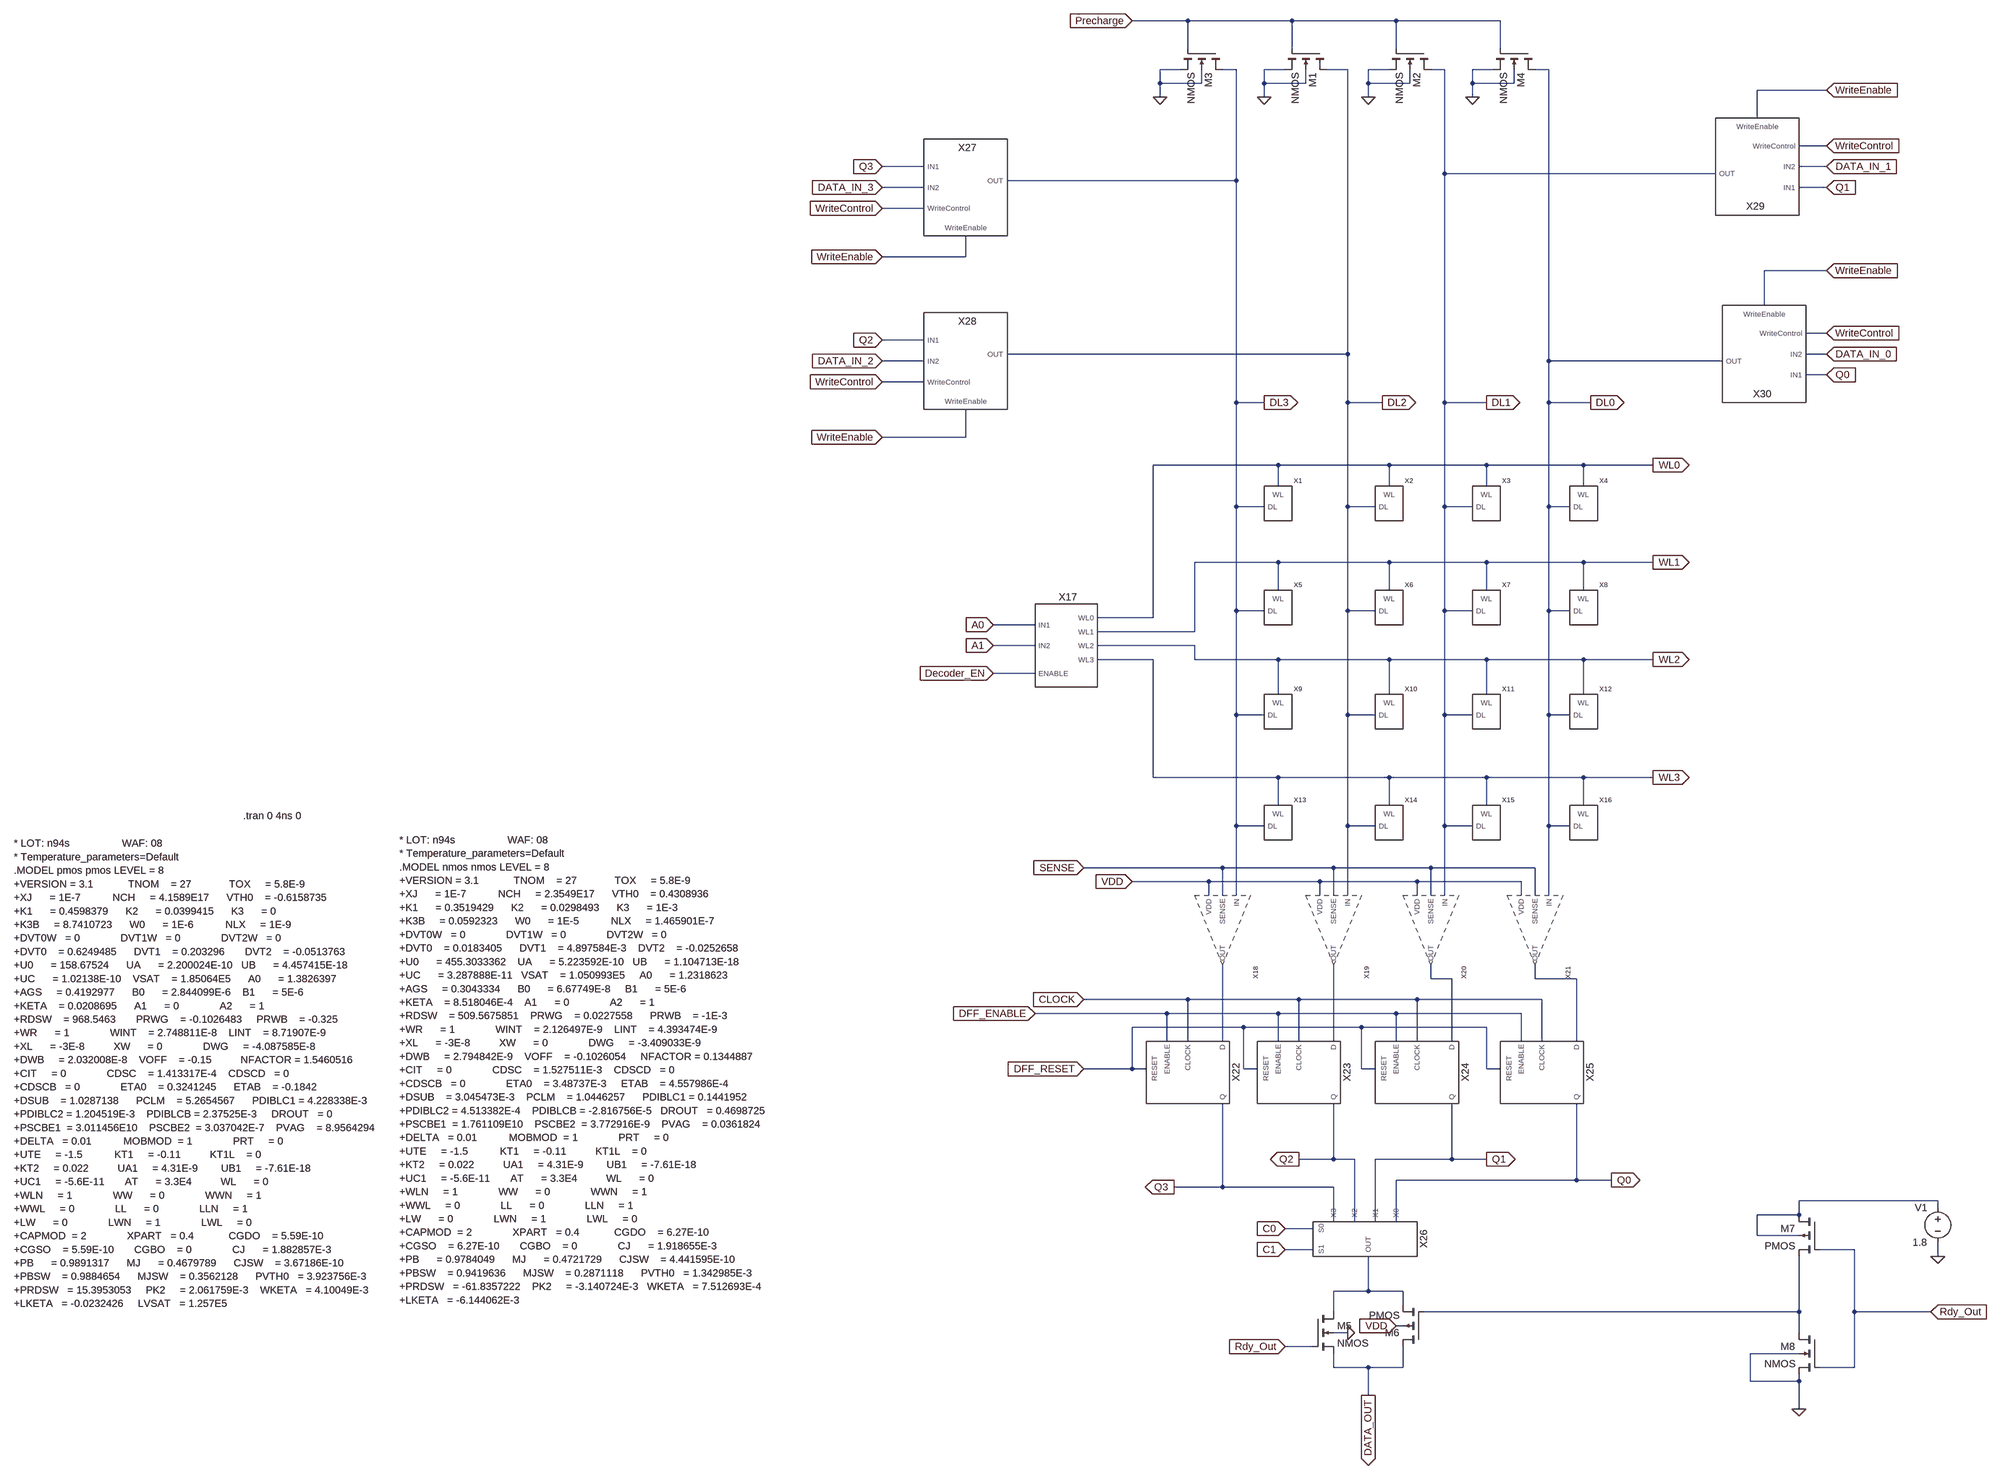
[diagram p0: schematic 4X4_DRAM.asc]
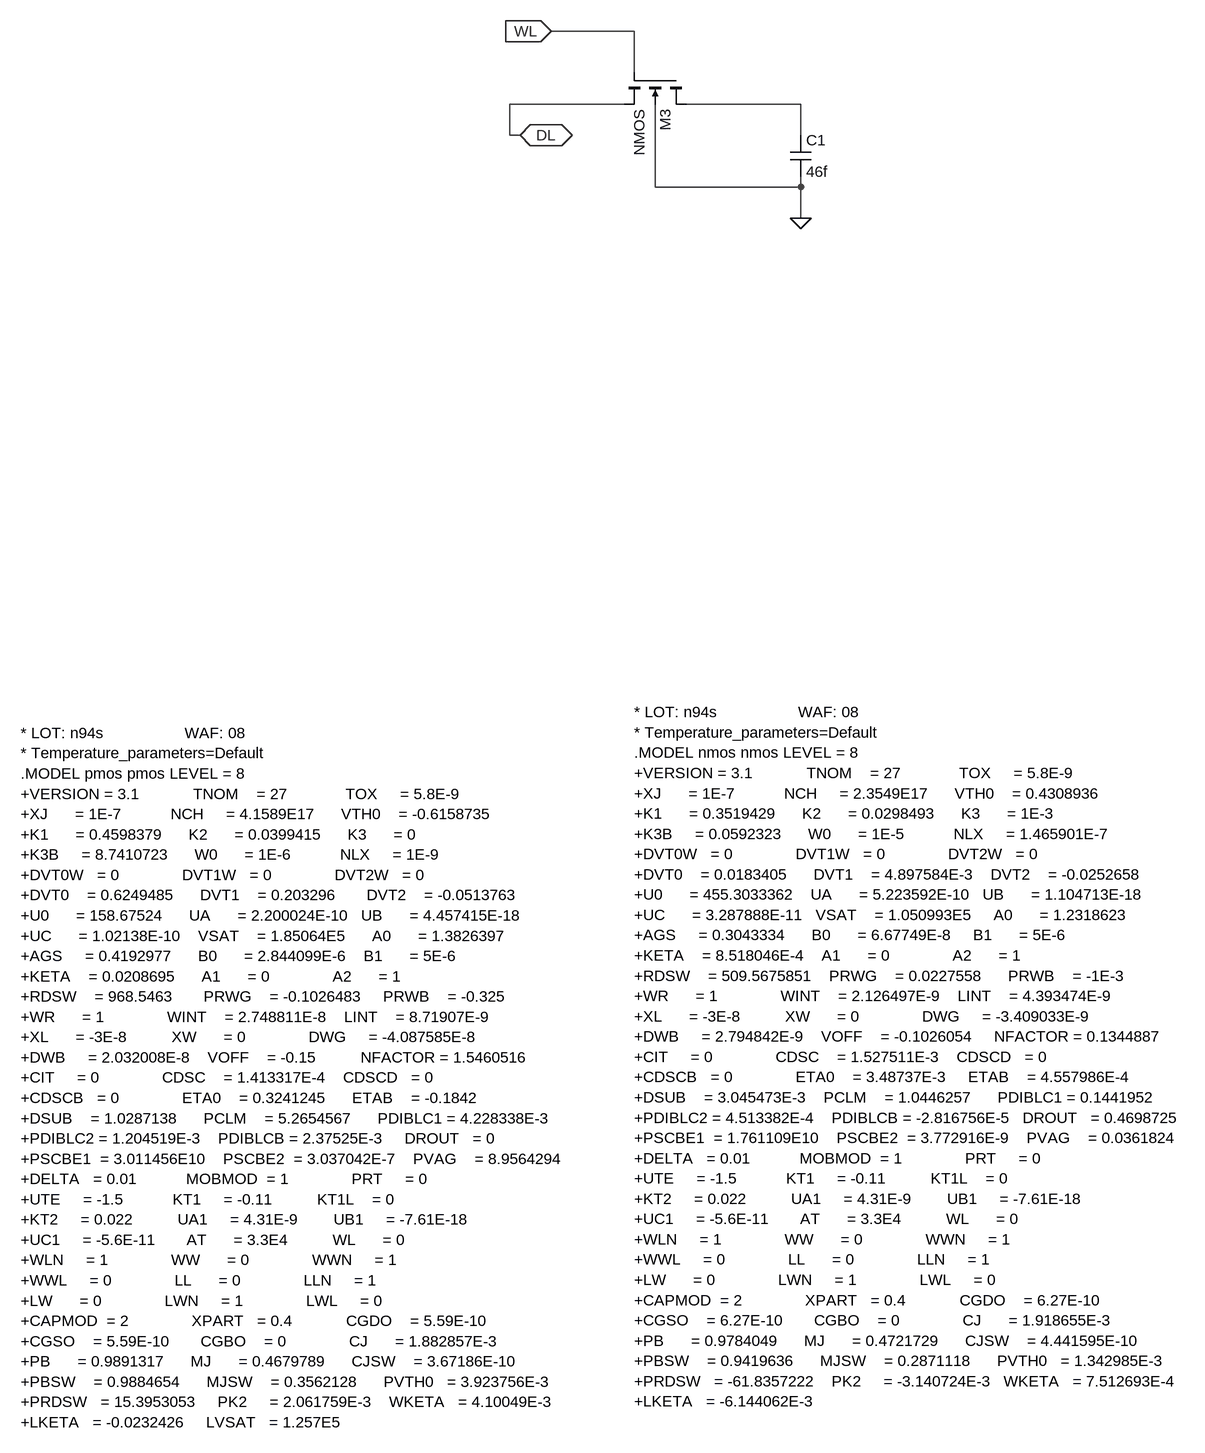
[diagram p1: sub-circuit 1t1c_cell.asc]
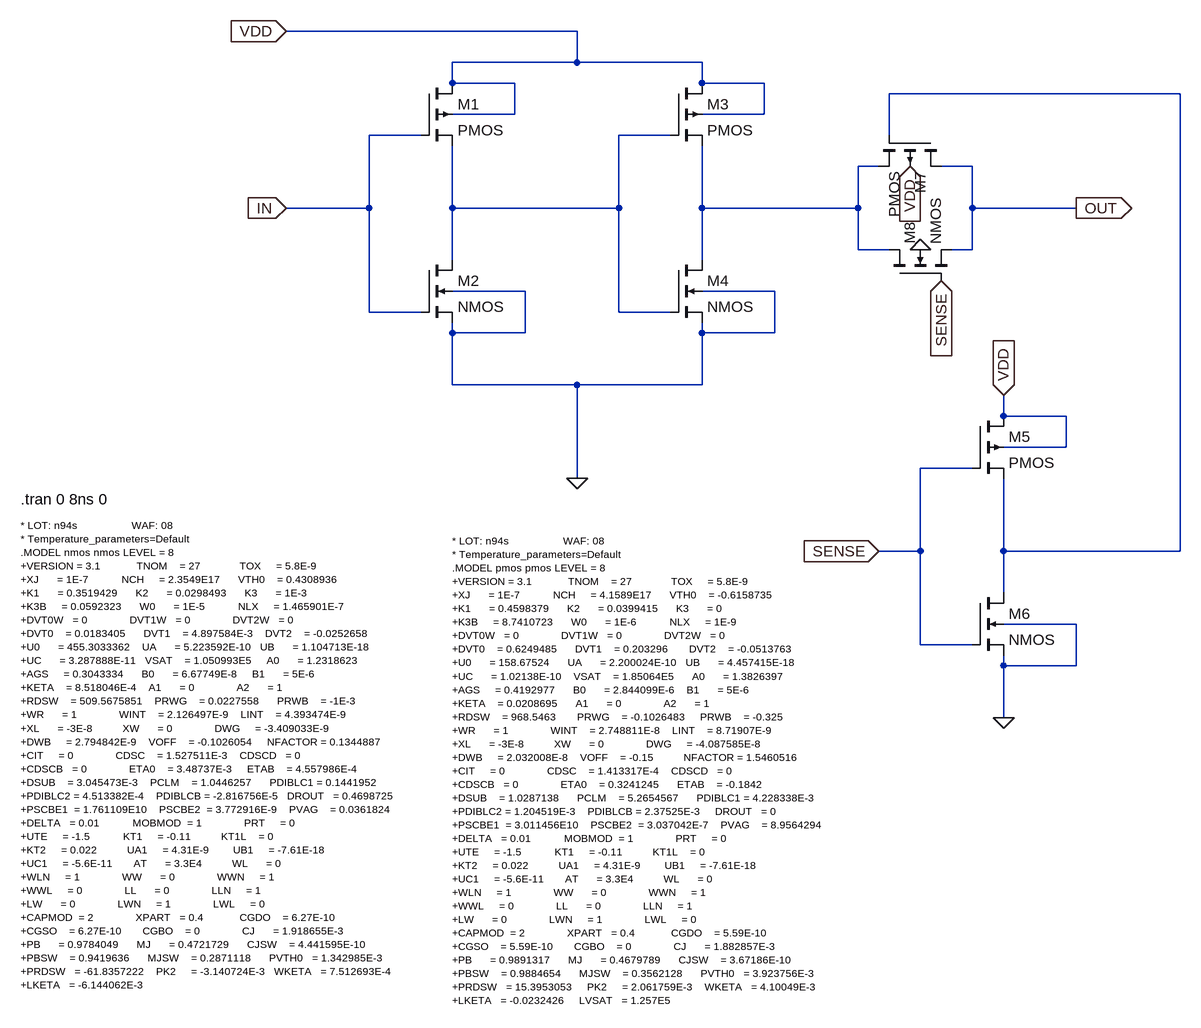
[diagram p2: sub-circuit sense_amplifier_en.asc]
4X4_DRAM.asc, the LTspice schematic file:
Version 4
SHEET 1 1972 2572
WIRE -640 -1056 -768 -1056
WIRE -400 -1056 -640 -1056
WIRE -160 -1056 -400 -1056
WIRE 80 -1056 -160 -1056
WIRE -640 -992 -640 -1056
WIRE -400 -992 -400 -1056
WIRE -160 -992 -160 -1056
WIRE 80 -992 80 -1056
WIRE -656 -944 -704 -944
WIRE -528 -944 -560 -944
WIRE -416 -944 -464 -944
WIRE -272 -944 -320 -944
WIRE -176 -944 -224 -944
WIRE -48 -944 -80 -944
WIRE 64 -944 16 -944
WIRE 192 -944 160 -944
WIRE -704 -912 -704 -944
WIRE -608 -912 -608 -944
WIRE -608 -912 -704 -912
WIRE -464 -912 -464 -944
WIRE -368 -912 -368 -944
WIRE -368 -912 -464 -912
WIRE -224 -912 -224 -944
WIRE -128 -912 -128 -944
WIRE -128 -912 -224 -912
WIRE 16 -912 16 -944
WIRE 112 -912 112 -944
WIRE 112 -912 16 -912
WIRE 832 -896 672 -896
WIRE -704 -880 -704 -912
WIRE -464 -880 -464 -912
WIRE -224 -880 -224 -912
WIRE 16 -880 16 -912
WIRE 672 -832 672 -896
WIRE 832 -768 768 -768
WIRE -1248 -720 -1344 -720
WIRE 832 -720 768 -720
WIRE -48 -704 -48 -944
WIRE 576 -704 -48 -704
WIRE -528 -688 -528 -944
WIRE -528 -688 -1056 -688
WIRE -1248 -672 -1344 -672
WIRE 832 -672 768 -672
WIRE -1248 -624 -1344 -624
WIRE -1152 -512 -1152 -560
WIRE -1152 -512 -1344 -512
WIRE 832 -480 688 -480
WIRE 688 -400 688 -480
WIRE 832 -336 784 -336
WIRE -1248 -320 -1344 -320
WIRE -272 -288 -272 -944
WIRE -272 -288 -1056 -288
WIRE 832 -288 784 -288
WIRE -1248 -272 -1344 -272
WIRE 192 -272 192 -944
WIRE 592 -272 192 -272
WIRE 832 -240 784 -240
WIRE -1248 -224 -1344 -224
WIRE -528 -176 -528 -688
WIRE -464 -176 -528 -176
WIRE -272 -176 -272 -288
WIRE -192 -176 -272 -176
WIRE -48 -176 -48 -704
WIRE 48 -176 -48 -176
WIRE 192 -176 192 -272
WIRE 288 -176 192 -176
WIRE -1152 -96 -1152 -160
WIRE -1152 -96 -1344 -96
WIRE -432 -32 -720 -32
WIRE -176 -32 -432 -32
WIRE 48 -32 -176 -32
WIRE 272 -32 48 -32
WIRE 432 -32 272 -32
WIRE -432 16 -432 -32
WIRE -176 16 -176 -32
WIRE 48 16 48 -32
WIRE 272 16 272 -32
WIRE -528 64 -528 -176
WIRE -464 64 -528 64
WIRE -272 64 -272 -176
WIRE -208 64 -272 64
WIRE -48 64 -48 -176
WIRE 16 64 -48 64
WIRE 192 64 192 -176
WIRE 240 64 192 64
WIRE -432 192 -624 192
WIRE -176 192 -432 192
WIRE 48 192 -176 192
WIRE 272 192 48 192
WIRE 432 192 272 192
WIRE -432 256 -432 192
WIRE -176 256 -176 192
WIRE 48 256 48 192
WIRE 272 256 272 192
WIRE -528 304 -528 64
WIRE -464 304 -528 304
WIRE -272 304 -272 64
WIRE -208 304 -272 304
WIRE -48 304 -48 64
WIRE 16 304 -48 304
WIRE 192 304 192 64
WIRE 240 304 192 304
WIRE -720 320 -720 -32
WIRE -720 320 -848 320
WIRE -992 336 -1088 336
WIRE -624 352 -624 192
WIRE -624 352 -848 352
WIRE -992 384 -1088 384
WIRE -624 384 -848 384
WIRE -720 416 -848 416
WIRE -624 416 -624 384
WIRE -432 416 -624 416
WIRE -176 416 -432 416
WIRE 48 416 -176 416
WIRE 272 416 48 416
WIRE 432 416 272 416
WIRE -992 448 -1088 448
WIRE -432 496 -432 416
WIRE -176 496 -176 416
WIRE 48 496 48 416
WIRE 272 496 272 416
WIRE -528 544 -528 304
WIRE -464 544 -528 544
WIRE -272 544 -272 304
WIRE -208 544 -272 544
WIRE -48 544 -48 304
WIRE 16 544 -48 544
WIRE 192 544 192 304
WIRE 240 544 192 544
WIRE -720 688 -720 416
WIRE -432 688 -720 688
WIRE -176 688 -432 688
WIRE 48 688 -176 688
WIRE 272 688 48 688
WIRE 432 688 272 688
WIRE -432 752 -432 688
WIRE -176 752 -176 688
WIRE 48 752 48 688
WIRE 272 752 272 688
WIRE -528 800 -528 544
WIRE -464 800 -528 800
WIRE -272 800 -272 544
WIRE -208 800 -272 800
WIRE -48 800 -48 544
WIRE 16 800 -48 800
WIRE 192 800 192 544
WIRE 240 800 192 800
WIRE -560 896 -880 896
WIRE -304 896 -560 896
WIRE -80 896 -304 896
WIRE 160 896 -80 896
WIRE -592 928 -768 928
WIRE -336 928 -592 928
WIRE -112 928 -336 928
WIRE 128 928 -112 928
WIRE -592 960 -592 928
WIRE -560 960 -560 896
WIRE -528 960 -528 800
WIRE -336 960 -336 928
WIRE -304 960 -304 896
WIRE -272 960 -272 800
WIRE -112 960 -112 928
WIRE -80 960 -80 896
WIRE -48 960 -48 800
WIRE 128 960 128 928
WIRE 160 960 160 896
WIRE 192 960 192 800
WIRE -80 1152 -80 1120
WIRE -32 1152 -80 1152
WIRE 160 1152 160 1120
WIRE 256 1152 160 1152
WIRE -640 1200 -880 1200
WIRE -384 1200 -640 1200
WIRE -112 1200 -384 1200
WIRE 176 1200 -112 1200
WIRE -688 1232 -992 1232
WIRE -432 1232 -688 1232
WIRE -160 1232 -432 1232
WIRE 128 1232 -160 1232
WIRE -512 1264 -768 1264
WIRE -240 1264 -512 1264
WIRE 48 1264 -240 1264
WIRE -688 1296 -688 1232
WIRE -640 1296 -640 1200
WIRE -560 1296 -560 1120
WIRE -432 1296 -432 1232
WIRE -384 1296 -384 1200
WIRE -304 1296 -304 1120
WIRE -160 1296 -160 1232
WIRE -112 1296 -112 1200
WIRE -32 1296 -32 1152
WIRE 128 1296 128 1232
WIRE 176 1296 176 1200
WIRE 256 1296 256 1152
WIRE -768 1360 -768 1264
WIRE -768 1360 -880 1360
WIRE -736 1360 -768 1360
WIRE -512 1360 -512 1264
WIRE -480 1360 -512 1360
WIRE -240 1360 -240 1264
WIRE -208 1360 -240 1360
WIRE 48 1360 48 1264
WIRE 80 1360 48 1360
WIRE -304 1568 -304 1440
WIRE -304 1568 -384 1568
WIRE -256 1568 -304 1568
WIRE -32 1568 -32 1440
WIRE -32 1568 -208 1568
WIRE 48 1568 -32 1568
WIRE 256 1616 256 1440
WIRE 256 1616 -160 1616
WIRE 336 1616 256 1616
WIRE -560 1632 -560 1440
WIRE -560 1632 -672 1632
WIRE -304 1632 -560 1632
WIRE 1088 1664 768 1664
WIRE 1088 1680 1088 1664
WIRE 768 1696 768 1664
WIRE 768 1696 672 1696
WIRE -304 1712 -304 1632
WIRE -256 1712 -256 1568
WIRE -208 1712 -208 1568
WIRE -160 1712 -160 1616
WIRE -352 1728 -416 1728
WIRE 672 1744 672 1696
WIRE 768 1744 672 1744
WIRE -352 1776 -416 1776
WIRE 896 1776 816 1776
WIRE 1088 1792 1088 1760
WIRE -224 1872 -224 1792
WIRE -224 1872 -304 1872
WIRE -144 1872 -224 1872
WIRE -144 1904 -144 1872
WIRE -304 1920 -304 1872
WIRE 768 1920 768 1792
WIRE 768 1920 -96 1920
WIRE 896 1920 896 1776
WIRE 1072 1920 896 1920
WIRE -144 1952 -160 1952
WIRE -272 1968 -304 1968
WIRE 768 1968 768 1920
WIRE -352 2000 -416 2000
WIRE 768 2016 656 2016
WIRE -304 2048 -304 2016
WIRE -224 2048 -304 2048
WIRE -144 2048 -144 2000
WIRE -144 2048 -224 2048
WIRE 896 2048 896 1920
WIRE 896 2048 816 2048
WIRE 656 2080 656 2016
WIRE 768 2080 768 2064
WIRE 768 2080 656 2080
WIRE -224 2112 -224 2048
WIRE 768 2144 768 2080
FLAG -704 -880 0
FLAG -768 -1056 Precharge
IOPIN -768 -1056 In
FLAG -464 -880 0
FLAG -224 -880 0
FLAG 16 -880 0
FLAG -672 1632 Q3
IOPIN -672 1632 Out
FLAG -384 1568 Q2
IOPIN -384 1568 Out
FLAG 48 1568 Q1
IOPIN 48 1568 Out
FLAG 336 1616 Q0
IOPIN 336 1616 Out
FLAG -224 2112 DATA_OUT
IOPIN -224 2112 Out
FLAG -1344 -720 Q3
IOPIN -1344 -720 In
FLAG -1344 -672 DATA_IN_3
IOPIN -1344 -672 In
FLAG 832 -768 WriteControl
IOPIN 832 -768 In
FLAG 832 -672 Q1
IOPIN 832 -672 In
FLAG 832 -336 WriteControl
IOPIN 832 -336 In
FLAG 832 -288 DATA_IN_0
IOPIN 832 -288 In
FLAG 832 -240 Q0
IOPIN 832 -240 In
FLAG 832 -720 DATA_IN_1
IOPIN 832 -720 In
FLAG 832 -896 WriteEnable
IOPIN 832 -896 In
FLAG 832 -480 WriteEnable
IOPIN 832 -480 In
FLAG -1344 -624 WriteControl
IOPIN -1344 -624 In
FLAG -1344 -512 WriteEnable
IOPIN -1344 -512 In
FLAG -1344 -320 Q2
IOPIN -1344 -320 In
FLAG -1344 -272 DATA_IN_2
IOPIN -1344 -272 In
FLAG -1344 -224 WriteControl
IOPIN -1344 -224 In
FLAG -1344 -96 WriteEnable
IOPIN -1344 -96 In
FLAG -1088 336 A0
IOPIN -1088 336 In
FLAG -1088 384 A1
IOPIN -1088 384 In
FLAG -1088 448 Decoder_EN
IOPIN -1088 448 In
FLAG -880 1360 DFF_RESET
IOPIN -880 1360 In
FLAG -992 1232 DFF_ENABLE
IOPIN -992 1232 In
FLAG -880 1200 CLOCK
IOPIN -880 1200 In
FLAG -416 1728 C0
IOPIN -416 1728 In
FLAG -416 1776 C1
IOPIN -416 1776 In
FLAG -768 928 VDD
IOPIN -768 928 In
FLAG -880 896 SENSE
IOPIN -880 896 In
FLAG -160 1952 VDD
IOPIN -160 1952 In
FLAG -272 1968 0
FLAG 768 2144 0
FLAG 1088 1792 0
FLAG 1072 1920 Rdy_Out
IOPIN 1072 1920 In
FLAG -416 2000 Rdy_Out
IOPIN -416 2000 In
FLAG 432 -32 WL0
IOPIN 432 -32 Out
FLAG 432 192 WL1
IOPIN 432 192 Out
FLAG 432 416 WL2
IOPIN 432 416 Out
FLAG 432 688 WL3
IOPIN 432 688 Out
FLAG 288 -176 DL0
IOPIN 288 -176 Out
FLAG 48 -176 DL1
IOPIN 48 -176 Out
FLAG -192 -176 DL2
IOPIN -192 -176 Out
FLAG -464 -176 DL3
IOPIN -464 -176 Out
SYMBOL nmos4 -560 -992 R90
SYMATTR InstName M3
SYMATTR Value2 l=180n w=440n
SYMBOL 1T1C_CELL -432 64 R0
SYMATTR InstName X1
SYMBOL 1T1C_CELL -176 64 R0
SYMATTR InstName X2
SYMBOL 1T1C_CELL 48 64 R0
SYMATTR InstName X3
SYMBOL 1T1C_CELL 272 64 R0
SYMATTR InstName X4
SYMBOL 1T1C_CELL -432 304 R0
SYMATTR InstName X5
SYMBOL 1T1C_CELL -176 304 R0
SYMATTR InstName X6
SYMBOL 1T1C_CELL 48 304 R0
SYMATTR InstName X7
SYMBOL 1T1C_CELL 272 304 R0
SYMATTR InstName X8
SYMBOL 1T1C_CELL -432 544 R0
SYMATTR InstName X9
SYMBOL 1T1C_CELL -176 544 R0
SYMATTR InstName X10
SYMBOL 1T1C_CELL 48 544 R0
SYMATTR InstName X11
SYMBOL 1T1C_CELL 272 544 R0
SYMATTR InstName X12
SYMBOL 1T1C_CELL -432 800 R0
SYMATTR InstName X13
SYMBOL 1T1C_CELL -176 800 R0
SYMATTR InstName X14
SYMBOL 1T1C_CELL 48 800 R0
SYMATTR InstName X15
SYMBOL 1T1C_CELL 272 800 R0
SYMATTR InstName X16
SYMBOL nmos4 -320 -992 R90
SYMATTR InstName M1
SYMATTR Value2 l=180n w=440n
SYMBOL nmos4 -80 -992 R90
SYMATTR InstName M2
SYMATTR Value2 l=180n w=440n
SYMBOL nmos4 160 -992 R90
SYMATTR InstName M4
SYMATTR Value2 l=180n w=440n
SYMBOL 2x4_DECODER_En -912 368 R0
SYMATTR InstName X17
SYMBOL Sense_Amplifier_En -576 1040 R90
SYMATTR InstName X18
SYMBOL Sense_Amplifier_En -320 1040 R90
SYMATTR InstName X19
SYMBOL Sense_Amplifier_En -96 1040 R90
SYMATTR InstName X20
SYMBOL Sense_Amplifier_En 144 1040 R90
SYMATTR InstName X21
SYMBOL 4X1_MUX -240 1744 R90
SYMATTR InstName X26
SYMBOL 2x1_MUX -1120 -640 R0
SYMATTR InstName X27
SYMBOL 2x1_MUX -1120 -240 R0
SYMATTR InstName X28
SYMBOL 2x1_MUX 640 -752 R180
SYMATTR InstName X29
SYMBOL 2x1_MUX 656 -320 R180
SYMATTR InstName X30
SYMBOL nmos4 -352 1920 R0
SYMATTR InstName M5
SYMATTR Value2 l=180n w=440n
SYMBOL pmos4 -96 2000 R180
SYMATTR InstName M6
SYMATTR Value2 l=180n w=440n
SYMBOL pmos4 816 1696 M0
SYMATTR InstName M7
SYMATTR Value2 l=180n w=880n
SYMBOL nmos4 816 1968 M0
SYMATTR InstName M8
SYMATTR Value2 l=180n w=440n
SYMBOL Voltage 1088 1664 M0
SYMATTR InstName V1
SYMATTR Value 1.8
SYMBOL DFF_TG_INV_Ctrls -656 1360 R90
SYMATTR InstName X22
SYMBOL DFF_TG_INV_Ctrls -400 1360 R90
SYMATTR InstName X23
SYMBOL DFF_TG_INV_Ctrls -128 1360 R90
SYMATTR InstName X24
SYMBOL DFF_TG_INV_Ctrls 160 1360 R90
SYMATTR InstName X25
TEXT -2912 776 Left 2 !.tran 0 4ns 0
TEXT -2552 832 Left 2 !* LOT: n94s                  WAF: 08\n* Temperature_parameters=Default\n.MODEL nmos nmos LEVEL = 8\n+VERSION = 3.1            TNOM    = 27             TOX     = 5.8E-9\n+XJ      = 1E-7           NCH     = 2.3549E17      VTH0    = 0.4308936\n+K1      = 0.3519429      K2      = 0.0298493      K3      = 1E-3\n+K3B     = 0.0592323      W0      = 1E-5           NLX     = 1.465901E-7\n+DVT0W   = 0              DVT1W   = 0              DVT2W   = 0\n+DVT0    = 0.0183405      DVT1    = 4.897584E-3    DVT2    = -0.0252658\n+U0      = 455.3033362    UA      = 5.223592E-10   UB      = 1.104713E-18\n+UC      = 3.287888E-11   VSAT    = 1.050993E5     A0      = 1.2318623\n+AGS     = 0.3043334      B0      = 6.67749E-8     B1      = 5E-6\n+KETA    = 8.518046E-4    A1      = 0              A2      = 1\n+RDSW    = 509.5675851    PRWG    = 0.0227558      PRWB    = -1E-3\n+WR      = 1              WINT    = 2.126497E-9    LINT    = 4.393474E-9\n+XL      = -3E-8          XW      = 0              DWG     = -3.409033E-9\n+DWB     = 2.794842E-9    VOFF    = -0.1026054     NFACTOR = 0.1344887\n+CIT     = 0              CDSC    = 1.527511E-3    CDSCD   = 0\n+CDSCB   = 0              ETA0    = 3.48737E-3     ETAB    = 4.557986E-4\n+DSUB    = 3.045473E-3    PCLM    = 1.0446257      PDIBLC1 = 0.1441952\n+PDIBLC2 = 4.513382E-4    PDIBLCB = -2.816756E-5   DROUT   = 0.4698725\n+PSCBE1  = 1.761109E10    PSCBE2  = 3.772916E-9    PVAG    = 0.0361824\n+DELTA   = 0.01           MOBMOD  = 1              PRT     = 0\n+UTE     = -1.5           KT1     = -0.11          KT1L    = 0\n+KT2     = 0.022          UA1     = 4.31E-9        UB1     = -7.61E-18\n+UC1     = -5.6E-11       AT      = 3.3E4          WL      = 0\n+WLN     = 1              WW      = 0              WWN     = 1\n+WWL     = 0              LL      = 0              LLN     = 1\n+LW      = 0              LWN     = 1              LWL     = 0\n+CAPMOD  = 2              XPART   = 0.4            CGDO    = 6.27E-10\n+CGSO    = 6.27E-10       CGBO    = 0              CJ      = 1.918655E-3\n+PB      = 0.9784049      MJ      = 0.4721729      CJSW    = 4.441595E-10\n+PBSW    = 0.9419636      MJSW    = 0.2871118      PVTH0   = 1.342985E-3\n+PRDSW   = -61.8357222    PK2     = -3.140724E-3   WKETA   = 7.512693E-4\n+LKETA   = -6.144062E-3
TEXT -3440 840 Left 2 !* LOT: n94s                  WAF: 08\n* Temperature_parameters=Default\n.MODEL pmos pmos LEVEL = 8\n+VERSION = 3.1            TNOM    = 27             TOX     = 5.8E-9\n+XJ      = 1E-7           NCH     = 4.1589E17      VTH0    = -0.6158735\n+K1      = 0.4598379      K2      = 0.0399415      K3      = 0\n+K3B     = 8.7410723      W0      = 1E-6           NLX     = 1E-9\n+DVT0W   = 0              DVT1W   = 0              DVT2W   = 0\n+DVT0    = 0.6249485      DVT1    = 0.203296       DVT2    = -0.0513763\n+U0      = 158.67524      UA      = 2.200024E-10   UB      = 4.457415E-18\n+UC      = 1.02138E-10    VSAT    = 1.85064E5      A0      = 1.3826397\n+AGS     = 0.4192977      B0      = 2.844099E-6    B1      = 5E-6\n+KETA    = 0.0208695      A1      = 0              A2      = 1\n+RDSW    = 968.5463       PRWG    = -0.1026483     PRWB    = -0.325\n+WR      = 1              WINT    = 2.748811E-8    LINT    = 8.71907E-9\n+XL      = -3E-8          XW      = 0              DWG     = -4.087585E-8\n+DWB     = 2.032008E-8    VOFF    = -0.15          NFACTOR = 1.5460516\n+CIT     = 0              CDSC    = 1.413317E-4    CDSCD   = 0\n+CDSCB   = 0              ETA0    = 0.3241245      ETAB    = -0.1842\n+DSUB    = 1.0287138      PCLM    = 5.2654567      PDIBLC1 = 4.228338E-3\n+PDIBLC2 = 1.204519E-3    PDIBLCB = 2.37525E-3     DROUT   = 0\n+PSCBE1  = 3.011456E10    PSCBE2  = 3.037042E-7    PVAG    = 8.9564294\n+DELTA   = 0.01           MOBMOD  = 1              PRT     = 0\n+UTE     = -1.5           KT1     = -0.11          KT1L    = 0\n+KT2     = 0.022          UA1     = 4.31E-9        UB1     = -7.61E-18\n+UC1     = -5.6E-11       AT      = 3.3E4          WL      = 0\n+WLN     = 1              WW      = 0              WWN     = 1\n+WWL     = 0              LL      = 0              LLN     = 1\n+LW      = 0              LWN     = 1              LWL     = 0\n+CAPMOD  = 2              XPART   = 0.4            CGDO    = 5.59E-10\n+CGSO    = 5.59E-10       CGBO    = 0              CJ      = 1.882857E-3\n+PB      = 0.9891317      MJ      = 0.4679789      CJSW    = 3.67186E-10\n+PBSW    = 0.9884654      MJSW    = 0.3562128      PVTH0   = 3.923756E-3\n+PRDSW   = 15.3953053     PK2     = 2.061759E-3    WKETA   = 4.10049E-3\n+LKETA   = -0.0232426     LVSAT   = 1.257E5

1t1c_cell.asc, the sub-circuit schematic file:
Version 4
SHEET 1 1972 1692
WIRE -432 -256 -560 -256
WIRE -432 -192 -432 -256
WIRE -448 -144 -624 -144
WIRE -176 -144 -352 -144
WIRE -624 -96 -624 -144
WIRE -608 -96 -624 -96
WIRE -176 -96 -176 -144
WIRE -400 -16 -400 -144
WIRE -176 -16 -176 -32
WIRE -176 -16 -400 -16
WIRE -176 32 -176 -16
FLAG -176 32 0
FLAG -560 -256 WL
IOPIN -560 -256 In
FLAG -608 -96 DL
IOPIN -608 -96 BiDir
SYMBOL nmos4 -352 -192 R90
SYMATTR InstName M3
SYMATTR Value2 l=180n w=1760n
SYMBOL Cap -192 -96 R0
SYMATTR InstName C1
SYMATTR Value 46f
TEXT -432 792 Left 2 !* LOT: n94s                  WAF: 08\n* Temperature_parameters=Default\n.MODEL nmos nmos LEVEL = 8\n+VERSION = 3.1            TNOM    = 27             TOX     = 5.8E-9\n+XJ      = 1E-7           NCH     = 2.3549E17      VTH0    = 0.4308936\n+K1      = 0.3519429      K2      = 0.0298493      K3      = 1E-3\n+K3B     = 0.0592323      W0      = 1E-5           NLX     = 1.465901E-7\n+DVT0W   = 0              DVT1W   = 0              DVT2W   = 0\n+DVT0    = 0.0183405      DVT1    = 4.897584E-3    DVT2    = -0.0252658\n+U0      = 455.3033362    UA      = 5.223592E-10   UB      = 1.104713E-18\n+UC      = 3.287888E-11   VSAT    = 1.050993E5     A0      = 1.2318623\n+AGS     = 0.3043334      B0      = 6.67749E-8     B1      = 5E-6\n+KETA    = 8.518046E-4    A1      = 0              A2      = 1\n+RDSW    = 509.5675851    PRWG    = 0.0227558      PRWB    = -1E-3\n+WR      = 1              WINT    = 2.126497E-9    LINT    = 4.393474E-9\n+XL      = -3E-8          XW      = 0              DWG     = -3.409033E-9\n+DWB     = 2.794842E-9    VOFF    = -0.1026054     NFACTOR = 0.1344887\n+CIT     = 0              CDSC    = 1.527511E-3    CDSCD   = 0\n+CDSCB   = 0              ETA0    = 3.48737E-3     ETAB    = 4.557986E-4\n+DSUB    = 3.045473E-3    PCLM    = 1.0446257      PDIBLC1 = 0.1441952\n+PDIBLC2 = 4.513382E-4    PDIBLCB = -2.816756E-5   DROUT   = 0.4698725\n+PSCBE1  = 1.761109E10    PSCBE2  = 3.772916E-9    PVAG    = 0.0361824\n+DELTA   = 0.01           MOBMOD  = 1              PRT     = 0\n+UTE     = -1.5           KT1     = -0.11          KT1L    = 0\n+KT2     = 0.022          UA1     = 4.31E-9        UB1     = -7.61E-18\n+UC1     = -5.6E-11       AT      = 3.3E4          WL      = 0\n+WLN     = 1              WW      = 0              WWN     = 1\n+WWL     = 0              LL      = 0              LLN     = 1\n+LW      = 0              LWN     = 1              LWL     = 0\n+CAPMOD  = 2              XPART   = 0.4            CGDO    = 6.27E-10\n+CGSO    = 6.27E-10       CGBO    = 0              CJ      = 1.918655E-3\n+PB      = 0.9784049      MJ      = 0.4721729      CJSW    = 4.441595E-10\n+PBSW    = 0.9419636      MJSW    = 0.2871118      PVTH0   = 1.342985E-3\n+PRDSW   = -61.8357222    PK2     = -3.140724E-3   WKETA   = 7.512693E-4\n+LKETA   = -6.144062E-3
TEXT -1376 824 Left 2 !* LOT: n94s                  WAF: 08\n* Temperature_parameters=Default\n.MODEL pmos pmos LEVEL = 8\n+VERSION = 3.1            TNOM    = 27             TOX     = 5.8E-9\n+XJ      = 1E-7           NCH     = 4.1589E17      VTH0    = -0.6158735\n+K1      = 0.4598379      K2      = 0.0399415      K3      = 0\n+K3B     = 8.7410723      W0      = 1E-6           NLX     = 1E-9\n+DVT0W   = 0              DVT1W   = 0              DVT2W   = 0\n+DVT0    = 0.6249485      DVT1    = 0.203296       DVT2    = -0.0513763\n+U0      = 158.67524      UA      = 2.200024E-10   UB      = 4.457415E-18\n+UC      = 1.02138E-10    VSAT    = 1.85064E5      A0      = 1.3826397\n+AGS     = 0.4192977      B0      = 2.844099E-6    B1      = 5E-6\n+KETA    = 0.0208695      A1      = 0              A2      = 1\n+RDSW    = 968.5463       PRWG    = -0.1026483     PRWB    = -0.325\n+WR      = 1              WINT    = 2.748811E-8    LINT    = 8.71907E-9\n+XL      = -3E-8          XW      = 0              DWG     = -4.087585E-8\n+DWB     = 2.032008E-8    VOFF    = -0.15          NFACTOR = 1.5460516\n+CIT     = 0              CDSC    = 1.413317E-4    CDSCD   = 0\n+CDSCB   = 0              ETA0    = 0.3241245      ETAB    = -0.1842\n+DSUB    = 1.0287138      PCLM    = 5.2654567      PDIBLC1 = 4.228338E-3\n+PDIBLC2 = 1.204519E-3    PDIBLCB = 2.37525E-3     DROUT   = 0\n+PSCBE1  = 3.011456E10    PSCBE2  = 3.037042E-7    PVAG    = 8.9564294\n+DELTA   = 0.01           MOBMOD  = 1              PRT     = 0\n+UTE     = -1.5           KT1     = -0.11          KT1L    = 0\n+KT2     = 0.022          UA1     = 4.31E-9        UB1     = -7.61E-18\n+UC1     = -5.6E-11       AT      = 3.3E4          WL      = 0\n+WLN     = 1              WW      = 0              WWN     = 1\n+WWL     = 0              LL      = 0              LLN     = 1\n+LW      = 0              LWN     = 1              LWL     = 0\n+CAPMOD  = 2              XPART   = 0.4            CGDO    = 5.59E-10\n+CGSO    = 5.59E-10       CGBO    = 0              CJ      = 1.882857E-3\n+PB      = 0.9891317      MJ      = 0.4679789      CJSW    = 3.67186E-10\n+PBSW    = 0.9884654      MJSW    = 0.3562128      PVTH0   = 3.923756E-3\n+PRDSW   = 15.3953053     PK2     = 2.061759E-3    WKETA   = 4.10049E-3\n+LKETA   = -0.0232426     LVSAT   = 1.257E5

sense_amplifier_en.asc, the sub-circuit schematic file:
Version 4
SHEET 1 2420 1288
WIRE 336 -16 -112 -16
WIRE 336 32 336 -16
WIRE 336 32 144 32
WIRE 528 32 336 32
WIRE 144 64 144 32
WIRE 240 64 144 64
WIRE 528 64 528 32
WIRE 624 64 528 64
WIRE 1264 80 816 80
WIRE 240 112 240 64
WIRE 240 112 144 112
WIRE 624 112 624 64
WIRE 624 112 528 112
WIRE 96 144 16 144
WIRE 480 144 400 144
WIRE 816 144 816 80
WIRE 800 192 768 192
WIRE 944 192 896 192
WIRE 16 256 16 144
WIRE 16 256 -112 256
WIRE 144 256 144 160
WIRE 400 256 400 144
WIRE 400 256 144 256
WIRE 528 256 528 160
WIRE 768 256 768 192
WIRE 768 256 528 256
WIRE 944 256 944 192
WIRE 1104 256 944 256
WIRE 768 320 768 256
WIRE 816 320 768 320
WIRE 944 320 944 256
WIRE 944 320 912 320
WIRE 144 336 144 256
WIRE 528 336 528 256
WIRE 256 384 144 384
WIRE 640 384 528 384
WIRE 16 416 16 256
WIRE 96 416 16 416
WIRE 400 416 400 256
WIRE 480 416 400 416
WIRE 144 448 144 432
WIRE 256 448 256 384
WIRE 256 448 144 448
WIRE 528 448 528 432
WIRE 640 448 640 384
WIRE 640 448 528 448
WIRE 144 528 144 448
WIRE 336 528 144 528
WIRE 528 528 528 448
WIRE 528 528 336 528
WIRE 992 576 992 544
WIRE 1088 576 992 576
WIRE 1088 624 1088 576
WIRE 1088 624 992 624
WIRE 944 656 864 656
WIRE 336 672 336 528
WIRE 864 784 864 656
WIRE 864 784 800 784
WIRE 992 784 992 672
WIRE 1264 784 1264 80
WIRE 1264 784 992 784
WIRE 992 848 992 784
WIRE 1104 896 992 896
WIRE 864 928 864 784
WIRE 944 928 864 928
WIRE 992 960 992 944
WIRE 1104 960 1104 896
WIRE 1104 960 992 960
WIRE 992 1040 992 960
FLAG 1104 256 OUT
IOPIN 1104 256 Out
FLAG -112 -16 VDD
IOPIN -112 -16 In
FLAG -112 256 IN
IOPIN -112 256 In
FLAG 336 672 0
FLAG 800 784 SENSE
IOPIN 800 784 In
FLAG 992 1040 0
FLAG 992 544 VDD
IOPIN 992 544 In
FLAG 864 320 0
FLAG 848 192 VDD
IOPIN 848 192 In
FLAG 896 368 SENSE
IOPIN 896 368 In
SYMBOL pmos4 96 64 R0
SYMATTR InstName M1
SYMATTR Value2 l=180n w=880n
SYMBOL nmos4 96 336 R0
SYMATTR InstName M2
SYMATTR Value2 l=180n w=440n
SYMBOL pmos4 480 64 R0
SYMATTR InstName M3
SYMATTR Value2 l=180n w=880n
SYMBOL nmos4 480 336 R0
SYMATTR InstName M4
SYMATTR Value2 l=180n w=440n
SYMBOL pmos4 944 576 R0
SYMATTR InstName M5
SYMATTR Value2 l=180n w=880n
SYMBOL nmos4 944 848 R0
SYMATTR InstName M6
SYMATTR Value2 l=180n w=440n
SYMBOL pmos4 896 144 R90
SYMATTR InstName M7
SYMATTR Value2 l=180n w=880n
SYMBOL nmos4 816 368 R270
SYMATTR InstName M8
SYMATTR Value2 l=180n w=440n
TEXT -520 744 Left 1 !* LOT: n94s                  WAF: 08\n* Temperature_parameters=Default\n.MODEL nmos nmos LEVEL = 8\n+VERSION = 3.1            TNOM    = 27             TOX     = 5.8E-9\n+XJ      = 1E-7           NCH     = 2.3549E17      VTH0    = 0.4308936\n+K1      = 0.3519429      K2      = 0.0298493      K3      = 1E-3\n+K3B     = 0.0592323      W0      = 1E-5           NLX     = 1.465901E-7\n+DVT0W   = 0              DVT1W   = 0              DVT2W   = 0\n+DVT0    = 0.0183405      DVT1    = 4.897584E-3    DVT2    = -0.0252658\n+U0      = 455.3033362    UA      = 5.223592E-10   UB      = 1.104713E-18\n+UC      = 3.287888E-11   VSAT    = 1.050993E5     A0      = 1.2318623\n+AGS     = 0.3043334      B0      = 6.67749E-8     B1      = 5E-6\n+KETA    = 8.518046E-4    A1      = 0              A2      = 1\n+RDSW    = 509.5675851    PRWG    = 0.0227558      PRWB    = -1E-3\n+WR      = 1              WINT    = 2.126497E-9    LINT    = 4.393474E-9\n+XL      = -3E-8          XW      = 0              DWG     = -3.409033E-9\n+DWB     = 2.794842E-9    VOFF    = -0.1026054     NFACTOR = 0.1344887\n+CIT     = 0              CDSC    = 1.527511E-3    CDSCD   = 0\n+CDSCB   = 0              ETA0    = 3.48737E-3     ETAB    = 4.557986E-4\n+DSUB    = 3.045473E-3    PCLM    = 1.0446257      PDIBLC1 = 0.1441952\n+PDIBLC2 = 4.513382E-4    PDIBLCB = -2.816756E-5   DROUT   = 0.4698725\n+PSCBE1  = 1.761109E10    PSCBE2  = 3.772916E-9    PVAG    = 0.0361824\n+DELTA   = 0.01           MOBMOD  = 1              PRT     = 0\n+UTE     = -1.5           KT1     = -0.11          KT1L    = 0\n+KT2     = 0.022          UA1     = 4.31E-9        UB1     = -7.61E-18\n+UC1     = -5.6E-11       AT      = 3.3E4          WL      = 0\n+WLN     = 1              WW      = 0              WWN     = 1\n+WWL     = 0              LL      = 0              LLN     = 1\n+LW      = 0              LWN     = 1              LWL     = 0\n+CAPMOD  = 2              XPART   = 0.4            CGDO    = 6.27E-10\n+CGSO    = 6.27E-10       CGBO    = 0              CJ      = 1.918655E-3\n+PB      = 0.9784049      MJ      = 0.4721729      CJSW    = 4.441595E-10\n+PBSW    = 0.9419636      MJSW    = 0.2871118      PVTH0   = 1.342985E-3\n+PRDSW   = -61.8357222    PK2     = -3.140724E-3   WKETA   = 7.512693E-4\n+LKETA   = -6.144062E-3
TEXT 144 768 Left 1 !* LOT: n94s                  WAF: 08\n* Temperature_parameters=Default\n.MODEL pmos pmos LEVEL = 8\n+VERSION = 3.1            TNOM    = 27             TOX     = 5.8E-9\n+XJ      = 1E-7           NCH     = 4.1589E17      VTH0    = -0.6158735\n+K1      = 0.4598379      K2      = 0.0399415      K3      = 0\n+K3B     = 8.7410723      W0      = 1E-6           NLX     = 1E-9\n+DVT0W   = 0              DVT1W   = 0              DVT2W   = 0\n+DVT0    = 0.6249485      DVT1    = 0.203296       DVT2    = -0.0513763\n+U0      = 158.67524      UA      = 2.200024E-10   UB      = 4.457415E-18\n+UC      = 1.02138E-10    VSAT    = 1.85064E5      A0      = 1.3826397\n+AGS     = 0.4192977      B0      = 2.844099E-6    B1      = 5E-6\n+KETA    = 0.0208695      A1      = 0              A2      = 1\n+RDSW    = 968.5463       PRWG    = -0.1026483     PRWB    = -0.325\n+WR      = 1              WINT    = 2.748811E-8    LINT    = 8.71907E-9\n+XL      = -3E-8          XW      = 0              DWG     = -4.087585E-8\n+DWB     = 2.032008E-8    VOFF    = -0.15          NFACTOR = 1.5460516\n+CIT     = 0              CDSC    = 1.413317E-4    CDSCD   = 0\n+CDSCB   = 0              ETA0    = 0.3241245      ETAB    = -0.1842\n+DSUB    = 1.0287138      PCLM    = 5.2654567      PDIBLC1 = 4.228338E-3\n+PDIBLC2 = 1.204519E-3    PDIBLCB = 2.37525E-3     DROUT   = 0\n+PSCBE1  = 3.011456E10    PSCBE2  = 3.037042E-7    PVAG    = 8.9564294\n+DELTA   = 0.01           MOBMOD  = 1              PRT     = 0\n+UTE     = -1.5           KT1     = -0.11          KT1L    = 0\n+KT2     = 0.022          UA1     = 4.31E-9        UB1     = -7.61E-18\n+UC1     = -5.6E-11       AT      = 3.3E4          WL      = 0\n+WLN     = 1              WW      = 0              WWN     = 1\n+WWL     = 0              LL      = 0              LLN     = 1\n+LW      = 0              LWN     = 1              LWL     = 0\n+CAPMOD  = 2              XPART   = 0.4            CGDO    = 5.59E-10\n+CGSO    = 5.59E-10       CGBO    = 0              CJ      = 1.882857E-3\n+PB      = 0.9891317      MJ      = 0.4679789      CJSW    = 3.67186E-10\n+PBSW    = 0.9884654      MJSW    = 0.3562128      PVTH0   = 3.923756E-3\n+PRDSW   = 15.3953053     PK2     = 2.061759E-3    WKETA   = 4.10049E-3\n+LKETA   = -0.0232426     LVSAT   = 1.257E5
TEXT -520 704 Left 2 !.tran 0 8ns 0

The netlist it stands for:
* 4X4_DRAM.asc
M3 DL3 Precharge 0 0 NMOS l=180n w=440n
XX1 DL3 WL0 1t1c_cell
XX2 DL2 WL0 1t1c_cell
XX3 DL1 WL0 1t1c_cell
XX4 DL0 WL0 1t1c_cell
XX5 DL3 WL1 1t1c_cell
XX6 DL2 WL1 1t1c_cell
XX7 DL1 WL1 1t1c_cell
XX8 DL0 WL1 1t1c_cell
XX9 DL3 WL2 1t1c_cell
XX10 DL2 WL2 1t1c_cell
XX11 DL1 WL2 1t1c_cell
XX12 DL0 WL2 1t1c_cell
XX13 DL3 WL3 1t1c_cell
XX14 DL2 WL3 1t1c_cell
XX15 DL1 WL3 1t1c_cell
XX16 DL0 WL3 1t1c_cell
M1 DL2 Precharge 0 0 NMOS l=180n w=440n
M2 DL1 Precharge 0 0 NMOS l=180n w=440n
M4 DL0 Precharge 0 0 NMOS l=180n w=440n
XX17 Decoder_EN A0 A1 WL0 WL1 WL2 WL3 2x4_DECODER_En  ; pins ENABLE IN1 IN2 WL0 WL1 WL2 WL3
XX18 DL3 SENSE VDD N003 sense_amplifier_en
XX19 DL2 SENSE VDD N004 sense_amplifier_en
XX20 DL1 SENSE VDD N001 sense_amplifier_en
XX21 DL0 SENSE VDD N002 sense_amplifier_en
XX26 N006 C0 C1 Q0 Q1 Q2 Q3 4X1_MUX  ; pins OUT S0 S1 X0 X1 X2 X3
XX27 Q3 DATA_IN_3 WriteControl WriteEnable DL3 2x1_MUX  ; pins IN1 IN2 WriteControl WriteEnable OUT
XX28 Q2 DATA_IN_2 WriteControl WriteEnable DL2 2x1_MUX  ; pins IN1 IN2 WriteControl WriteEnable OUT
XX29 Q1 DATA_IN_1 WriteControl WriteEnable DL1 2x1_MUX  ; pins IN1 IN2 WriteControl WriteEnable OUT
XX30 Q0 DATA_IN_0 WriteControl WriteEnable DL0 2x1_MUX  ; pins IN1 IN2 WriteControl WriteEnable OUT
M5 N006 Rdy_Out DATA_OUT 0 NMOS l=180n w=440n
M6 DATA_OUT N007 N006 VDD PMOS l=180n w=440n
M7 N005 Rdy_Out N007 N005 PMOS l=180n w=880n
M8 N007 Rdy_Out 0 0 NMOS l=180n w=440n
V1 N005 0 1.8
XX22 CLOCK N003 DFF_ENABLE DFF_RESET Q3 DFF_TG_INV_Ctrls  ; pins CLOCK D ENABLE RESET Q
XX23 CLOCK N004 DFF_ENABLE DFF_RESET Q2 DFF_TG_INV_Ctrls  ; pins CLOCK D ENABLE RESET Q
XX24 CLOCK N001 DFF_ENABLE DFF_RESET Q1 DFF_TG_INV_Ctrls  ; pins CLOCK D ENABLE RESET Q
XX25 CLOCK N002 DFF_ENABLE DFF_RESET Q0 DFF_TG_INV_Ctrls  ; pins CLOCK D ENABLE RESET Q

* block symbol definitions
.subckt 1t1c_cell DL WL
M3 N001 WL DL 0 NMOS l=180n w=1760n
C1 N001 0 46f
* LOT: n94s                  WAF: 08
* Temperature_parameters=Default
.MODEL nmos nmos LEVEL = 8
+VERSION = 3.1            TNOM    = 27             TOX     = 5.8E-9
+XJ      = 1E-7           NCH     = 2.3549E17      VTH0    = 0.4308936
+K1      = 0.3519429      K2      = 0.0298493      K3      = 1E-3
+K3B     = 0.0592323      W0      = 1E-5           NLX     = 1.465901E-7
+DVT0W   = 0              DVT1W   = 0              DVT2W   = 0
+DVT0    = 0.0183405      DVT1    = 4.897584E-3    DVT2    = -0.0252658
+U0      = 455.3033362    UA      = 5.223592E-10   UB      = 1.104713E-18
+UC      = 3.287888E-11   VSAT    = 1.050993E5     A0      = 1.2318623
+AGS     = 0.3043334      B0      = 6.67749E-8     B1      = 5E-6
+KETA    = 8.518046E-4    A1      = 0              A2      = 1
+RDSW    = 509.5675851    PRWG    = 0.0227558      PRWB    = -1E-3
+WR      = 1              WINT    = 2.126497E-9    LINT    = 4.393474E-9
+XL      = -3E-8          XW      = 0              DWG     = -3.409033E-9
+DWB     = 2.794842E-9    VOFF    = -0.1026054     NFACTOR = 0.1344887
+CIT     = 0              CDSC    = 1.527511E-3    CDSCD   = 0
+CDSCB   = 0              ETA0    = 3.48737E-3     ETAB    = 4.557986E-4
+DSUB    = 3.045473E-3    PCLM    = 1.0446257      PDIBLC1 = 0.1441952
+PDIBLC2 = 4.513382E-4    PDIBLCB = -2.816756E-5   DROUT   = 0.4698725
+PSCBE1  = 1.761109E10    PSCBE2  = 3.772916E-9    PVAG    = 0.0361824
+DELTA   = 0.01           MOBMOD  = 1              PRT     = 0
+UTE     = -1.5           KT1     = -0.11          KT1L    = 0
+KT2     = 0.022          UA1     = 4.31E-9        UB1     = -7.61E-18
+UC1     = -5.6E-11       AT      = 3.3E4          WL      = 0
+WLN     = 1              WW      = 0              WWN     = 1
+WWL     = 0              LL      = 0              LLN     = 1
+LW      = 0              LWN     = 1              LWL     = 0
+CAPMOD  = 2              XPART   = 0.4            CGDO    = 6.27E-10
+CGSO    = 6.27E-10       CGBO    = 0              CJ      = 1.918655E-3
+PB      = 0.9784049      MJ      = 0.4721729      CJSW    = 4.441595E-10
+PBSW    = 0.9419636      MJSW    = 0.2871118      PVTH0   = 1.342985E-3
+PRDSW   = -61.8357222    PK2     = -3.140724E-3   WKETA   = 7.512693E-4
+LKETA   = -6.144062E-3
* LOT: n94s                  WAF: 08
* Temperature_parameters=Default
.MODEL pmos pmos LEVEL = 8
+VERSION = 3.1            TNOM    = 27             TOX     = 5.8E-9
+XJ      = 1E-7           NCH     = 4.1589E17      VTH0    = -0.6158735
+K1      = 0.4598379      K2      = 0.0399415      K3      = 0
+K3B     = 8.7410723      W0      = 1E-6           NLX     = 1E-9
+DVT0W   = 0              DVT1W   = 0              DVT2W   = 0
+DVT0    = 0.6249485      DVT1    = 0.203296       DVT2    = -0.0513763
+U0      = 158.67524      UA      = 2.200024E-10   UB      = 4.457415E-18
+UC      = 1.02138E-10    VSAT    = 1.85064E5      A0      = 1.3826397
+AGS     = 0.4192977      B0      = 2.844099E-6    B1      = 5E-6
+KETA    = 0.0208695      A1      = 0              A2      = 1
+RDSW    = 968.5463       PRWG    = -0.1026483     PRWB    = -0.325
+WR      = 1              WINT    = 2.748811E-8    LINT    = 8.71907E-9
+XL      = -3E-8          XW      = 0              DWG     = -4.087585E-8
+DWB     = 2.032008E-8    VOFF    = -0.15          NFACTOR = 1.5460516
+CIT     = 0              CDSC    = 1.413317E-4    CDSCD   = 0
+CDSCB   = 0              ETA0    = 0.3241245      ETAB    = -0.1842
+DSUB    = 1.0287138      PCLM    = 5.2654567      PDIBLC1 = 4.228338E-3
+PDIBLC2 = 1.204519E-3    PDIBLCB = 2.37525E-3     DROUT   = 0
+PSCBE1  = 3.011456E10    PSCBE2  = 3.037042E-7    PVAG    = 8.9564294
+DELTA   = 0.01           MOBMOD  = 1              PRT     = 0
+UTE     = -1.5           KT1     = -0.11          KT1L    = 0
+KT2     = 0.022          UA1     = 4.31E-9        UB1     = -7.61E-18
+UC1     = -5.6E-11       AT      = 3.3E4          WL      = 0
+WLN     = 1              WW      = 0              WWN     = 1
+WWL     = 0              LL      = 0              LLN     = 1
+LW      = 0              LWN     = 1              LWL     = 0
+CAPMOD  = 2              XPART   = 0.4            CGDO    = 5.59E-10
+CGSO    = 5.59E-10       CGBO    = 0              CJ      = 1.882857E-3
+PB      = 0.9891317      MJ      = 0.4679789      CJSW    = 3.67186E-10
+PBSW    = 0.9884654      MJSW    = 0.3562128      PVTH0   = 3.923756E-3
+PRDSW   = 15.3953053     PK2     = 2.061759E-3    WKETA   = 4.10049E-3
+LKETA   = -0.0232426     LVSAT   = 1.257E5
.ends 1t1c_cell

.subckt sense_amplifier_en IN SENSE VDD OUT
M1 VDD IN N002 VDD PMOS l=180n w=880n
M2 N002 IN 0 0 NMOS l=180n w=440n
M3 VDD N002 N003 VDD PMOS l=180n w=880n
M4 N003 N002 0 0 NMOS l=180n w=440n
M5 VDD SENSE N001 VDD PMOS l=180n w=880n
M6 N001 SENSE 0 0 NMOS l=180n w=440n
M7 OUT N001 N003 VDD PMOS l=180n w=880n
M8 N003 SENSE OUT 0 NMOS l=180n w=440n
* LOT: n94s                  WAF: 08
* Temperature_parameters=Default
.MODEL nmos nmos LEVEL = 8
+VERSION = 3.1            TNOM    = 27             TOX     = 5.8E-9
+XJ      = 1E-7           NCH     = 2.3549E17      VTH0    = 0.4308936
+K1      = 0.3519429      K2      = 0.0298493      K3      = 1E-3
+K3B     = 0.0592323      W0      = 1E-5           NLX     = 1.465901E-7
+DVT0W   = 0              DVT1W   = 0              DVT2W   = 0
+DVT0    = 0.0183405      DVT1    = 4.897584E-3    DVT2    = -0.0252658
+U0      = 455.3033362    UA      = 5.223592E-10   UB      = 1.104713E-18
+UC      = 3.287888E-11   VSAT    = 1.050993E5     A0      = 1.2318623
+AGS     = 0.3043334      B0      = 6.67749E-8     B1      = 5E-6
+KETA    = 8.518046E-4    A1      = 0              A2      = 1
+RDSW    = 509.5675851    PRWG    = 0.0227558      PRWB    = -1E-3
+WR      = 1              WINT    = 2.126497E-9    LINT    = 4.393474E-9
+XL      = -3E-8          XW      = 0              DWG     = -3.409033E-9
+DWB     = 2.794842E-9    VOFF    = -0.1026054     NFACTOR = 0.1344887
+CIT     = 0              CDSC    = 1.527511E-3    CDSCD   = 0
+CDSCB   = 0              ETA0    = 3.48737E-3     ETAB    = 4.557986E-4
+DSUB    = 3.045473E-3    PCLM    = 1.0446257      PDIBLC1 = 0.1441952
+PDIBLC2 = 4.513382E-4    PDIBLCB = -2.816756E-5   DROUT   = 0.4698725
+PSCBE1  = 1.761109E10    PSCBE2  = 3.772916E-9    PVAG    = 0.0361824
+DELTA   = 0.01           MOBMOD  = 1              PRT     = 0
+UTE     = -1.5           KT1     = -0.11          KT1L    = 0
+KT2     = 0.022          UA1     = 4.31E-9        UB1     = -7.61E-18
+UC1     = -5.6E-11       AT      = 3.3E4          WL      = 0
+WLN     = 1              WW      = 0              WWN     = 1
+WWL     = 0              LL      = 0              LLN     = 1
+LW      = 0              LWN     = 1              LWL     = 0
+CAPMOD  = 2              XPART   = 0.4            CGDO    = 6.27E-10
+CGSO    = 6.27E-10       CGBO    = 0              CJ      = 1.918655E-3
+PB      = 0.9784049      MJ      = 0.4721729      CJSW    = 4.441595E-10
+PBSW    = 0.9419636      MJSW    = 0.2871118      PVTH0   = 1.342985E-3
+PRDSW   = -61.8357222    PK2     = -3.140724E-3   WKETA   = 7.512693E-4
+LKETA   = -6.144062E-3
* LOT: n94s                  WAF: 08
* Temperature_parameters=Default
.MODEL pmos pmos LEVEL = 8
+VERSION = 3.1            TNOM    = 27             TOX     = 5.8E-9
+XJ      = 1E-7           NCH     = 4.1589E17      VTH0    = -0.6158735
+K1      = 0.4598379      K2      = 0.0399415      K3      = 0
+K3B     = 8.7410723      W0      = 1E-6           NLX     = 1E-9
+DVT0W   = 0              DVT1W   = 0              DVT2W   = 0
+DVT0    = 0.6249485      DVT1    = 0.203296       DVT2    = -0.0513763
+U0      = 158.67524      UA      = 2.200024E-10   UB      = 4.457415E-18
+UC      = 1.02138E-10    VSAT    = 1.85064E5      A0      = 1.3826397
+AGS     = 0.4192977      B0      = 2.844099E-6    B1      = 5E-6
+KETA    = 0.0208695      A1      = 0              A2      = 1
+RDSW    = 968.5463       PRWG    = -0.1026483     PRWB    = -0.325
+WR      = 1              WINT    = 2.748811E-8    LINT    = 8.71907E-9
+XL      = -3E-8          XW      = 0              DWG     = -4.087585E-8
+DWB     = 2.032008E-8    VOFF    = -0.15          NFACTOR = 1.5460516
+CIT     = 0              CDSC    = 1.413317E-4    CDSCD   = 0
+CDSCB   = 0              ETA0    = 0.3241245      ETAB    = -0.1842
+DSUB    = 1.0287138      PCLM    = 5.2654567      PDIBLC1 = 4.228338E-3
+PDIBLC2 = 1.204519E-3    PDIBLCB = 2.37525E-3     DROUT   = 0
+PSCBE1  = 3.011456E10    PSCBE2  = 3.037042E-7    PVAG    = 8.9564294
+DELTA   = 0.01           MOBMOD  = 1              PRT     = 0
+UTE     = -1.5           KT1     = -0.11          KT1L    = 0
+KT2     = 0.022          UA1     = 4.31E-9        UB1     = -7.61E-18
+UC1     = -5.6E-11       AT      = 3.3E4          WL      = 0
+WLN     = 1              WW      = 0              WWN     = 1
+WWL     = 0              LL      = 0              LLN     = 1
+LW      = 0              LWN     = 1              LWL     = 0
+CAPMOD  = 2              XPART   = 0.4            CGDO    = 5.59E-10
+CGSO    = 5.59E-10       CGBO    = 0              CJ      = 1.882857E-3
+PB      = 0.9891317      MJ      = 0.4679789      CJSW    = 3.67186E-10
+PBSW    = 0.9884654      MJSW    = 0.3562128      PVTH0   = 3.923756E-3
+PRDSW   = 15.3953053     PK2     = 2.061759E-3    WKETA   = 4.10049E-3
+LKETA   = -0.0232426     LVSAT   = 1.257E5
.tran 0 8ns 0
.ends sense_amplifier_en

.model NMOS NMOS
.model PMOS PMOS
.lib standard.mos
.tran 0 4ns 0
* LOT: n94s                  WAF: 08
* Temperature_parameters=Default
.MODEL nmos nmos LEVEL = 8
+VERSION = 3.1            TNOM    = 27             TOX     = 5.8E-9
+XJ      = 1E-7           NCH     = 2.3549E17      VTH0    = 0.4308936
+K1      = 0.3519429      K2      = 0.0298493      K3      = 1E-3
+K3B     = 0.0592323      W0      = 1E-5           NLX     = 1.465901E-7
+DVT0W   = 0              DVT1W   = 0              DVT2W   = 0
+DVT0    = 0.0183405      DVT1    = 4.897584E-3    DVT2    = -0.0252658
+U0      = 455.3033362    UA      = 5.223592E-10   UB      = 1.104713E-18
+UC      = 3.287888E-11   VSAT    = 1.050993E5     A0      = 1.2318623
+AGS     = 0.3043334      B0      = 6.67749E-8     B1      = 5E-6
+KETA    = 8.518046E-4    A1      = 0              A2      = 1
+RDSW    = 509.5675851    PRWG    = 0.0227558      PRWB    = -1E-3
+WR      = 1              WINT    = 2.126497E-9    LINT    = 4.393474E-9
+XL      = -3E-8          XW      = 0              DWG     = -3.409033E-9
+DWB     = 2.794842E-9    VOFF    = -0.1026054     NFACTOR = 0.1344887
+CIT     = 0              CDSC    = 1.527511E-3    CDSCD   = 0
+CDSCB   = 0              ETA0    = 3.48737E-3     ETAB    = 4.557986E-4
+DSUB    = 3.045473E-3    PCLM    = 1.0446257      PDIBLC1 = 0.1441952
+PDIBLC2 = 4.513382E-4    PDIBLCB = -2.816756E-5   DROUT   = 0.4698725
+PSCBE1  = 1.761109E10    PSCBE2  = 3.772916E-9    PVAG    = 0.0361824
+DELTA   = 0.01           MOBMOD  = 1              PRT     = 0
+UTE     = -1.5           KT1     = -0.11          KT1L    = 0
+KT2     = 0.022          UA1     = 4.31E-9        UB1     = -7.61E-18
+UC1     = -5.6E-11       AT      = 3.3E4          WL      = 0
+WLN     = 1              WW      = 0              WWN     = 1
+WWL     = 0              LL      = 0              LLN     = 1
+LW      = 0              LWN     = 1              LWL     = 0
+CAPMOD  = 2              XPART   = 0.4            CGDO    = 6.27E-10
+CGSO    = 6.27E-10       CGBO    = 0              CJ      = 1.918655E-3
+PB      = 0.9784049      MJ      = 0.4721729      CJSW    = 4.441595E-10
+PBSW    = 0.9419636      MJSW    = 0.2871118      PVTH0   = 1.342985E-3
+PRDSW   = -61.8357222    PK2     = -3.140724E-3   WKETA   = 7.512693E-4
+LKETA   = -6.144062E-3
* LOT: n94s                  WAF: 08
* Temperature_parameters=Default
.MODEL pmos pmos LEVEL = 8
+VERSION = 3.1            TNOM    = 27             TOX     = 5.8E-9
+XJ      = 1E-7           NCH     = 4.1589E17      VTH0    = -0.6158735
+K1      = 0.4598379      K2      = 0.0399415      K3      = 0
+K3B     = 8.7410723      W0      = 1E-6           NLX     = 1E-9
+DVT0W   = 0              DVT1W   = 0              DVT2W   = 0
+DVT0    = 0.6249485      DVT1    = 0.203296       DVT2    = -0.0513763
+U0      = 158.67524      UA      = 2.200024E-10   UB      = 4.457415E-18
+UC      = 1.02138E-10    VSAT    = 1.85064E5      A0      = 1.3826397
+AGS     = 0.4192977      B0      = 2.844099E-6    B1      = 5E-6
+KETA    = 0.0208695      A1      = 0              A2      = 1
+RDSW    = 968.5463       PRWG    = -0.1026483     PRWB    = -0.325
+WR      = 1              WINT    = 2.748811E-8    LINT    = 8.71907E-9
+XL      = -3E-8          XW      = 0              DWG     = -4.087585E-8
+DWB     = 2.032008E-8    VOFF    = -0.15          NFACTOR = 1.5460516
+CIT     = 0              CDSC    = 1.413317E-4    CDSCD   = 0
+CDSCB   = 0              ETA0    = 0.3241245      ETAB    = -0.1842
+DSUB    = 1.0287138      PCLM    = 5.2654567      PDIBLC1 = 4.228338E-3
+PDIBLC2 = 1.204519E-3    PDIBLCB = 2.37525E-3     DROUT   = 0
+PSCBE1  = 3.011456E10    PSCBE2  = 3.037042E-7    PVAG    = 8.9564294
+DELTA   = 0.01           MOBMOD  = 1              PRT     = 0
+UTE     = -1.5           KT1     = -0.11          KT1L    = 0
+KT2     = 0.022          UA1     = 4.31E-9        UB1     = -7.61E-18
+UC1     = -5.6E-11       AT      = 3.3E4          WL      = 0
+WLN     = 1              WW      = 0              WWN     = 1
+WWL     = 0              LL      = 0              LLN     = 1
+LW      = 0              LWN     = 1              LWL     = 0
+CAPMOD  = 2              XPART   = 0.4            CGDO    = 5.59E-10
+CGSO    = 5.59E-10       CGBO    = 0              CJ      = 1.882857E-3
+PB      = 0.9891317      MJ      = 0.4679789      CJSW    = 3.67186E-10
+PBSW    = 0.9884654      MJSW    = 0.3562128      PVTH0   = 3.923756E-3
+PRDSW   = 15.3953053     PK2     = 2.061759E-3    WKETA   = 4.10049E-3
+LKETA   = -0.0232426     LVSAT   = 1.257E5
.backanno
.end